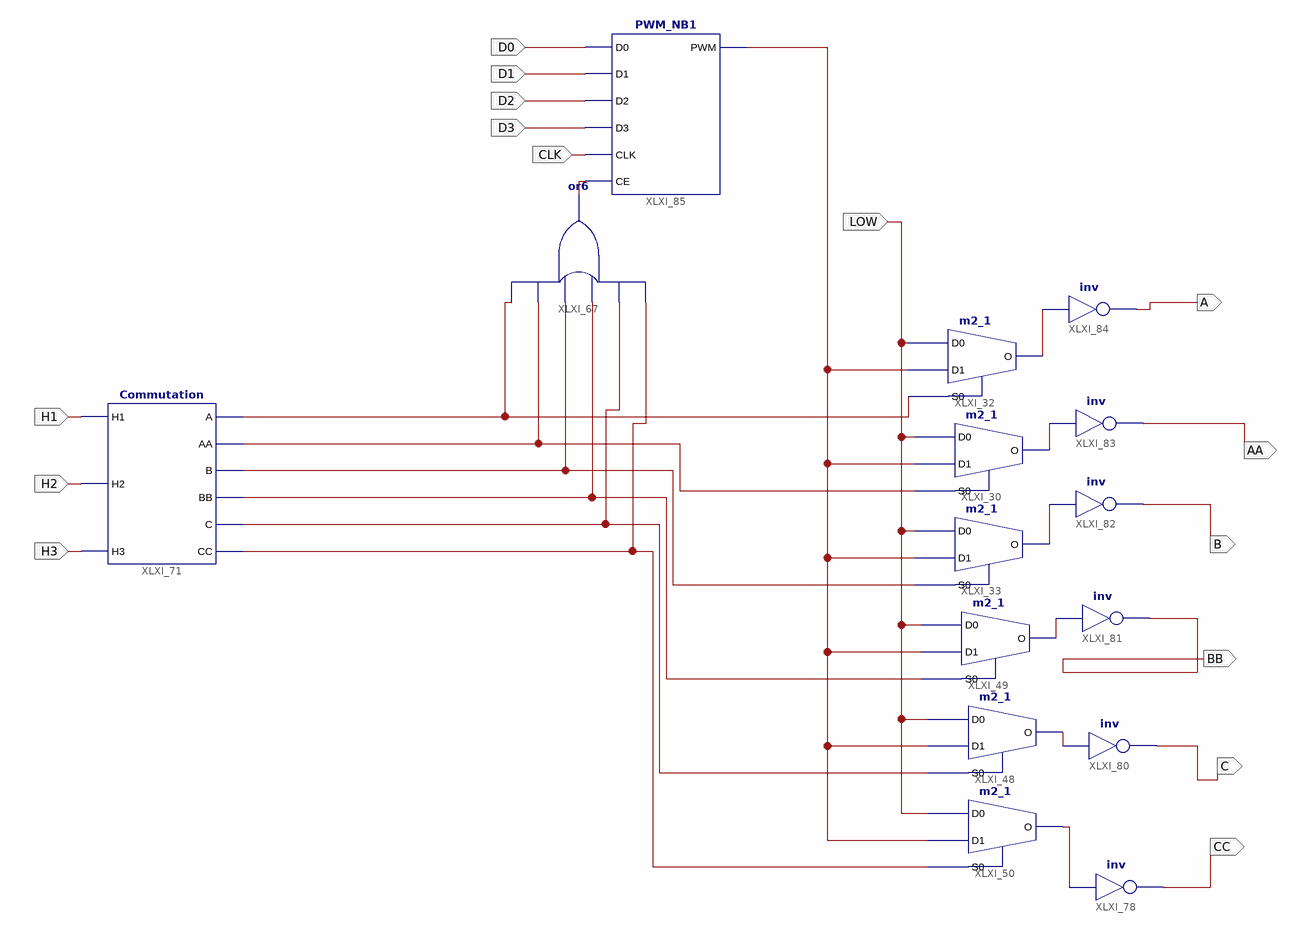
[diagram p0: schematic sheet 1]
// Xilinx ISE schematic MAIN_1.sch (spartan3e) as structural Verilog: 15 symbols, 15 ports
module MAIN_1 (
  input  H3,
  input  H2,
  input  H1,
  input  LOW,
  input  D3,
  input  D2,
  input  D1,
  input  D0,
  input  CLK,
  output BB,
  output CC,
  output AA,
  output A,
  output B,
  output C
);

  wire XLXN_113, XLXN_114, XLXN_115, XLXN_116, XLXN_124, XLXN_128, XLXN_129, XLXN_130;

  m2_1 XLXI_30 (.D0(LOW), .D1(XLXN_128), .S0(XLXN_130), .O(AA));
  m2_1 XLXI_32 (.D0(LOW), .D1(XLXN_128), .S0(XLXN_124), .O(A));
  m2_1 XLXI_33 (.D0(LOW), .D1(XLXN_128), .S0(XLXN_113), .O(B));
  m2_1 XLXI_49 (.D0(LOW), .D1(XLXN_128), .S0(XLXN_114), .O(BB));
  m2_1 XLXI_50 (.D0(LOW), .D1(XLXN_128), .S0(XLXN_116), .O(CC));
  m2_1 XLXI_48 (.D0(LOW), .D1(XLXN_128), .S0(XLXN_115), .O(C));
  or XLXI_67 (XLXN_129, XLXN_116, XLXN_115, XLXN_114, XLXN_113, XLXN_130, XLXN_124);
  Commutation XLXI_71 (
    .H1(H1), .H2(H2), .H3(H3), .A(XLXN_124), .AA(XLXN_130), .B(XLXN_113), .BB(XLXN_114), .C(XLXN_115),
    .CC(XLXN_116));
  not XLXI_78 (CC, CC);
  not XLXI_80 (C, C);
  not XLXI_81 (BB, BB);
  not XLXI_82 (B, B);
  not XLXI_83 (AA, AA);
  not XLXI_84 (A, A);
  PWM_NB1 XLXI_85 (.D0(D0), .D1(D1), .D2(D2), .D3(D3), .CLK(CLK), .CE(XLXN_129), .PWM(XLXN_128));
endmodule
